# Altium schematic sheet Connectors.SchDoc: Connectors
size Letter; SheetNumber: 6; SheetTotal: 12
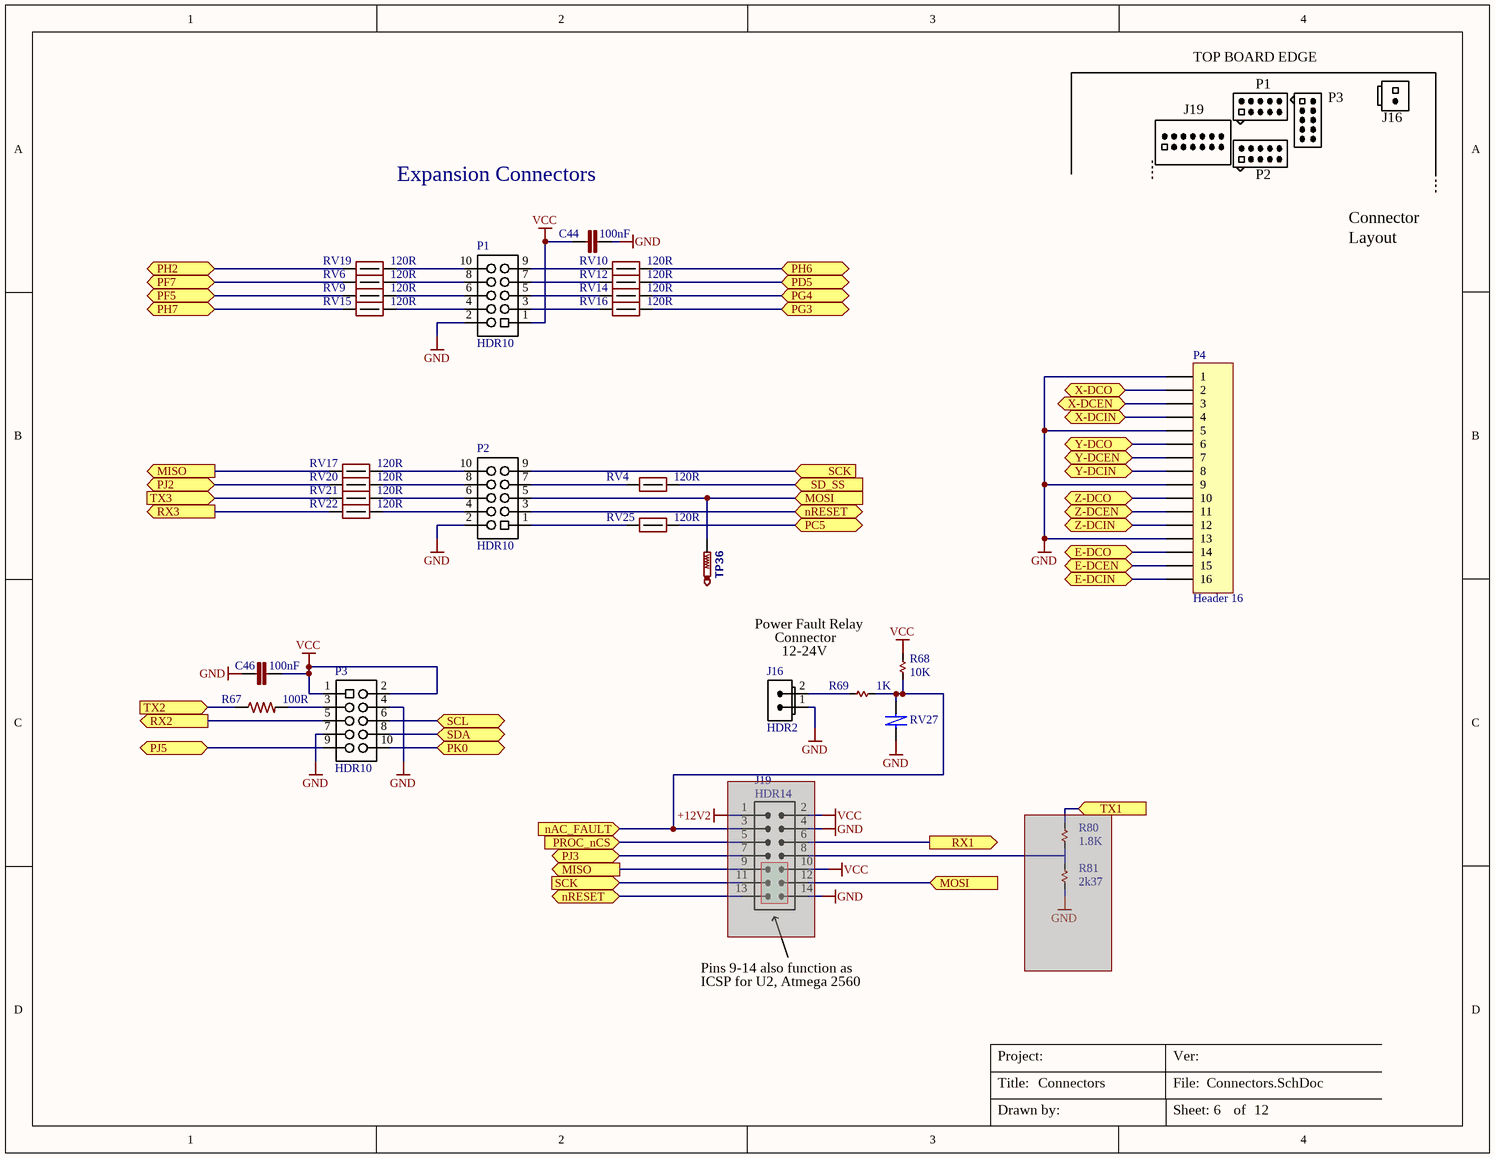
[diagram p0: Connectors.SchDoc]

## Parts
C44  100nF  [C0402]
C46  100nF  [C0402]
J16  value HDR2  [70543-02]  (hidden comment: CONN 2PIN VERT 0.1" SHRD LOCKING)
J19  HDR14  [HDR2x7_SMT_BOT_ENTRY]  (masked out: inside a compile mask, not in the netlist)
P1  HDR10  [HDR2X5 IDC]
P2  HDR10  [HDR2X5 IDC]
P3  HDR10  [HDR2X5 IDC THIEVING]
P4  Header 16  [HDR1X16]
R67  100R  [R0402]
R68  10K  [R0402]
R69  1K  [R0402]
R80  1.8K  [R0402]  (masked out: inside a compile mask, not in the netlist)
R81  2k37  [R0402]  (masked out: inside a compile mask, not in the netlist)
RV4  120R  [R0402]
RV6  120R  [R0402]
RV9  120R  [R0402]
RV10  120R  [R0402]
RV12  120R  [R0402]
RV14  120R  [R0402]
RV15  120R  [R0402]
RV16  120R  [R0402]
RV17  120R  [R0402]
RV19  120R  [R0402]
RV20  120R  [R0402]
RV21  120R  [R0402]
RV22  120R  [R0402]
RV25  120R  [R0402]
RV27  VRS0402SR55R101N  [C0402]  (value not drawn)
TP36  TestPoint  [TP1-27]  (value not drawn)  (no BOM)

## Ports
E-DCEN, E-DCIN, E-DCO, MISO, MOSI, nAC_FAULT, nRESET, PC5, PD5, PF5, PF7, PG3, PG4, PH2, PH6, PH7, PJ2, PJ3, PJ5, PK0, PROC_nCS, RX1, RX2, RX3, SCK, SCL, SD_SS, SDA, TX1, TX2, TX3, X-DCEN, X-DCIN, X-DCO, Y-DCEN, Y-DCIN, Y-DCO, Z-DCEN, Z-DCIN, Z-DCO

## Nets
GND: C44.2 C46.1 J16.1(S) P1.2 P2.2 P3.4 P3.7 P4.1 P4.5 P4.9 P4.13 RV27.1
VCC: C44.1 C46.2 P1.1 P3.1 P3.2 R68.2
E-DCEN: P4.15 ; port E-DCEN
E-DCIN: P4.16 ; port E-DCIN
E-DCO: P4.14 ; port E-DCO
MISO: RV17.1 ; port MISO
MOSI: P2.5 TP36.TP ; port MOSI
nAC_FAULT: R68.1 R69.2 RV27.2 ; port nAC_FAULT
nRESET: P2.3 ; port nRESET
PC5: RV25.2 ; port PC5
PD5: RV12.2 ; port PD5
PF5: RV9.1 ; port PF5
PF7: RV6.1 ; port PF7
PG3: RV16.2 ; port PG3
PG4: RV14.2 ; port PG4
PH2: RV19.1 ; port PH2
PH6: RV10.2 ; port PH6
PH7: RV15.1 ; port PH7
PJ2: RV20.1 ; port PJ2
PJ5: P3.9 ; port PJ5
PK0: P3.10 ; port PK0
RX2: P3.5 ; port RX2
RX3: RV22.1 ; port RX3
SCK: P2.9 ; port SCK
SCL: P3.6 ; port SCL
SD_SS: RV4.2 ; port SD_SS
SDA: P3.8 ; port SDA
TX2: R67.1 ; port TX2
TX3: RV21.1 ; port TX3
X-DCEN: P4.3 ; port X-DCEN
X-DCIN: P4.4 ; port X-DCIN
X-DCO: P4.2 ; port X-DCO
Y-DCEN: P4.7 ; port Y-DCEN
Y-DCIN: P4.8 ; port Y-DCIN
Y-DCO: P4.6 ; port Y-DCO
Z-DCEN: P4.11 ; port Z-DCEN
Z-DCIN: P4.12 ; port Z-DCIN
Z-DCO: P4.10 ; port Z-DCO
NetJ16_2: J16.2(S) R69.1
NetP1_3: P1.3 RV16.1
NetP1_4: P1.4 RV15.2
NetP1_5: P1.5 RV14.1
NetP1_6: P1.6 RV9.2
NetP1_7: P1.7 RV12.1
NetP1_8: P1.8 RV6.2
NetP1_9: P1.9 RV10.1
NetP1_10: P1.10 RV19.2
NetP2_1: P2.1 RV25.1
NetP2_4: P2.4 RV22.2
NetP2_6: P2.6 RV21.2
NetP2_7: P2.7 RV4.1
NetP2_8: P2.8 RV20.2
NetP2_10: P2.10 RV17.2
NetP3_3: P3.3 R67.2

## Notes on the sheet
- TOP BOARD EDGE
- P1
- P3
- J19
- J16
- Expansion Connectors
- P2
- Connector
- Layout
- (near R68) Power Fault Relay
- 12-24V
- Pins 9-14 also function as
- ICSP for U2, Atmega 2560
- Title:
- Project:
- File:
- Ver:
- Drawn by:
- Sheet:
- of

## Library data of the parts
C44 C46 = GRM155R71C104KA88D: CAP CER 0402 100nF 16V 10% X7R; MANUFACTURER: Murata; PART DESCRIPTION: 0.10µF ±10% 16V Ceramic Capacitor X7R 0402 (1005 Metric); TOLERANCE: +/- 10%; EE_SPEC: 100nF 16V X7R 0402; VALUE: 100nF; MANUFACTURER #: GRM155R71C104KA88D; DISTRIBUTOR #: 490-3261-2-ND; DISTRIBUTOR: Digi-Key; PART: 100nF
J16 = CONN 2PIN VERT 0.1" SHRD LOCKING: Connector 2pos; MANUFACTURER: Molex; MANUFACTURER #: 0705430001; PART: 10 Pin Conn; PART DESCRIPTION: 2 Positions Header, Shrouded Connector 0.100" (2.54mm) Through Hole Gold; TOLERANCE: -NA-; DISTRIBUTOR #: WM4800-ND; DISTRIBUTOR: Digi-Key; EE_SPEC: -NA-
J19 = CONN 14PIN 0.1" FEMALE 2-ROW SMT BOT-ENTRY: CONN RCPT DUAL ENTRY 14POS .100"; MANUFACTURER: TE Connectivity; MANUFACTURER #: 969973-7; PART DESCRIPTION: 14 Position Receptacle, Bottom or Top Entry Connector Gold 0.100" (2.54mm) Surface Mount; TOLERANCE: -NA-; DISTRIBUTOR #: A107060CT-ND; DISTRIBUTOR: Digikey; PART: HDR14; EE_SPEC: -NA-; VALUE: HDR14
P1-P3 = Header 10PIN 2ROW T-HOLE VERT SHROUDED: CONN HEADER VERT 10POS GOLD; MANUFACTURER #: 302-S101; MANUFACTURER: On Shore; PART DESCRIPTION: 10 Positions Header Connector 0.100" (2.54mm) Through Hole Gold; TOLERANCE: -NA-; DISTRIBUTOR #: ED1543-ND; DISTRIBUTOR: Digikey; PART: HDR10; VALUE: HDR10; EE_SPEC: -NA-
P4 = Header 16: Header, 16-Pin; LatestRevisionDate: 17-Jul-2002; LatestRevisionNote: Re-released for DXP Platform.; Publisher: Altium Limited
R67 = RES 100R 0402 1%: RES SMD 100 OHM 1% 1/16W 0402; MANUFACTURER: Yageo; MANUFACTURER #: RC0402FR-07100RL; PART: 100R 1% 0402; PART DESCRIPTION: 100 Ohm ±1% 0.063W, 1/16W Chip Resistor 0402 (1005 Metric) Moisture Resistant Thick Film; VALUE: 100R; DISTRIBUTOR #: 311-100LRTR-ND; DISTRIBUTOR: Digi-Key; TOLERANCE: 1%; EE_SPEC: 100R 1% 0402
R68 = 10k 1% 0402: RES SMD 10K OHM 1% 1/16W 0402; MANUFACTURER: Yageo; MANUFACTURER #: RC0402FR-0710KP; PART DESCRIPTION: 10k Ohm ±1% 0.063W, 1/16W Chip Resistor 0402 (1005 Metric) Moisture Resistant Thick Film; EE_SPEC: 10k 1% 0402 1/16W; DISTRIBUTOR #: YAG1249TR-ND; DISTRIBUTOR: Digi-key; PART: 10k 1% 0402; TOLERANCE: 1%; VALUE: 10K
R69 = RC0402FR-071KL: RES SMD 1K OHM 1% 1/16W 0402; Manufacturer: Yageo; Part Description: 1k Ohm ±1% 0.063W, 1/16W Chip Resistor 0402 (1005 Metric) Moisture Resistant Thick Film; EE_SPEC: 1k 1% 0402; Tolerance: +/- 1%; VALUE: 1K; MANUFACTURER #: RC0402FR-071KL; DISTRIBUTOR #: 311-1.00KLRTR-ND; DISTRIBUTOR: Digi-Key; PART: 1k
R80 = RC0402FR-071K8L: RES SMD 1.8K OHM 1% 1/16W 0402; Manufacturer: Yageo; Part Description: 1.8k Ohm ±1% 0.063W, 1/16W Chip Resistor 0402 (1005 Metric) Moisture Resistant Thick Film; EE_SPEC: 1.8k 1% 0402; Tolerance: +/- 1%; VALUE: 1.8K; MANUFACTURER #: RC0402FR-071K8L; DISTRIBUTOR #: 311-1.80KLRTR-ND; DISTRIBUTOR: Digi-Key; PART: 1.8k
R81 = RC0402FR-072K37L: RES SMD 2.37K OHM 1% 1/16W 0402; Manufacturer: Yageo; Part Description: 2.37k Ohm ±1% 0.063W, 1/16W Chip Resistor 0402 (1005 Metric) Moisture Resistant Thick Film; EE_SPEC: 2.37k 1% 0402; Tolerance: +/- 1%; VALUE: 2k37; MANUFACTURER #: RC0402FR-072K37L; DISTRIBUTOR #: 311-2.37KLRTR-ND; DISTRIBUTOR: Digi-Key; PART: 2.37k
RV4 RV6 RV9 RV10 RV12 RV14-RV17 RV19-RV22 RV25 = FERRITE 120R 1A 0402: FERRITE BEAD 120 OHM 0402 1LN; MANUFACTURER: Taiyo Yuden; MANUFACTURER #: BKP1005HS121-T; VALUE: 120Rfb; TOLERANCE: -NA-; EE_SPEC: 1A; DISTRIBUTOR #: 587-1921-2-ND; DISTRIBUTOR: Digikey; PART: FERRITE 120R 1A 0402; PART DESCRIPTION: FERRITE BEAD 120 OHM 0402 1LN
RV27 = VRS0402SR55R101N: Multi-Layer Varistor; Manufacturer: Yageo; Part Description: VARISTOR 12V 10A 0402; Value: 12V; EE_SPEC: 5.5Vdc 12Vvar 60pF; Tolerance: NA; DISTRIBUTOR #: 311-1516-2-ND; DISTRIBUTOR: Digi-Key; MANUFACTURER #: VRS0402SR55R101N; PART: 12V
TP36 = TestPoint: Test Point